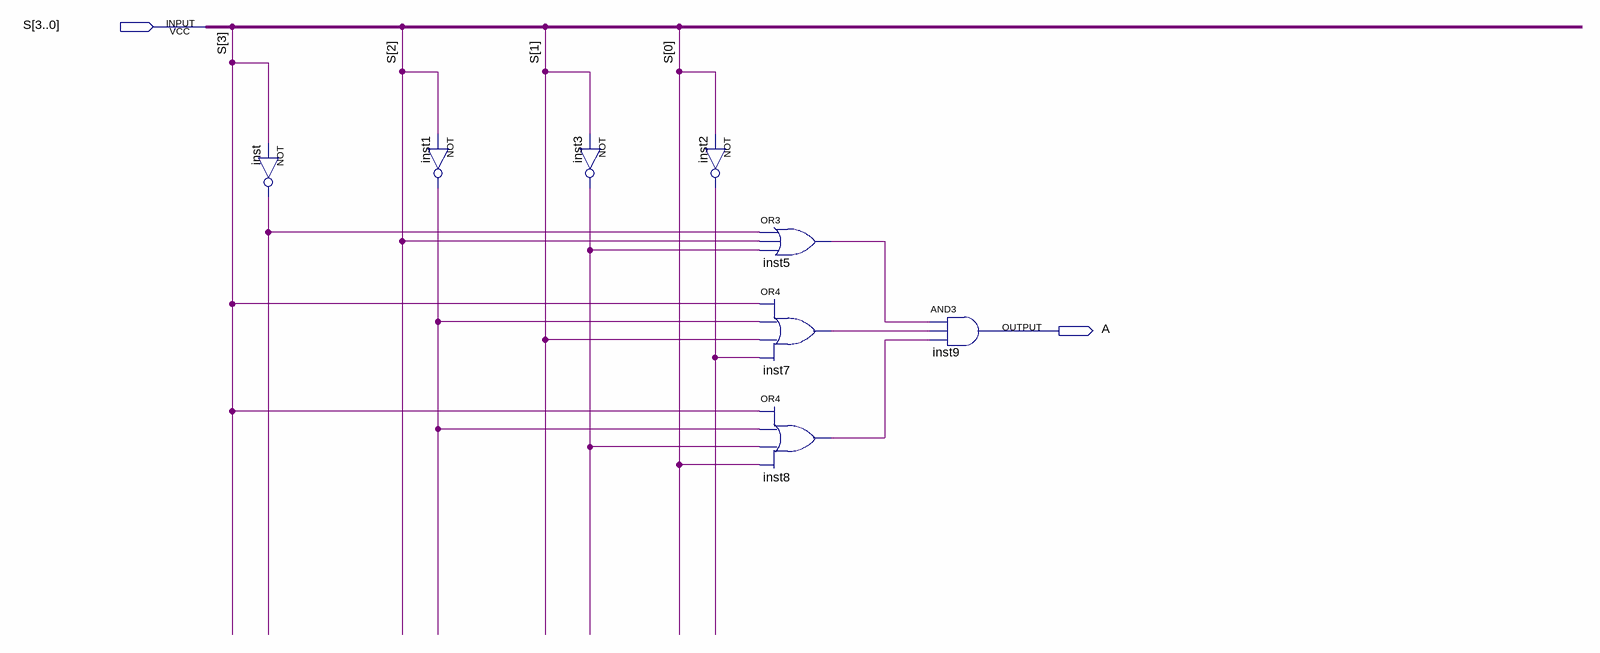
[diagram p0: schematic sheet]
// Quartus schematic DisplayA.bdf as structural Verilog: 8 symbols, 2 pins
module DisplayA (
  input  [3:0] S,
  output A
);

  wire inst1_out, inst2_out, inst3_out, inst5_out, inst7_out, inst8_out, inst_out;

  not inst (inst_out, S[3]);
  not inst1 (inst1_out, S[2]);
  not inst3 (inst3_out, S[1]);
  not inst2 (inst2_out, S[0]);
  or inst5 (inst5_out, inst_out, S[2], inst3_out);
  or inst7 (inst7_out, S[3], inst1_out, S[1], inst2_out);
  or inst8 (inst8_out, S[3], inst1_out, inst3_out, S[0]);
  and inst9 (A, inst5_out, inst7_out, inst8_out);
endmodule
